# EAGLE design LurkerNanov20 (EAGLE 6.6.0)
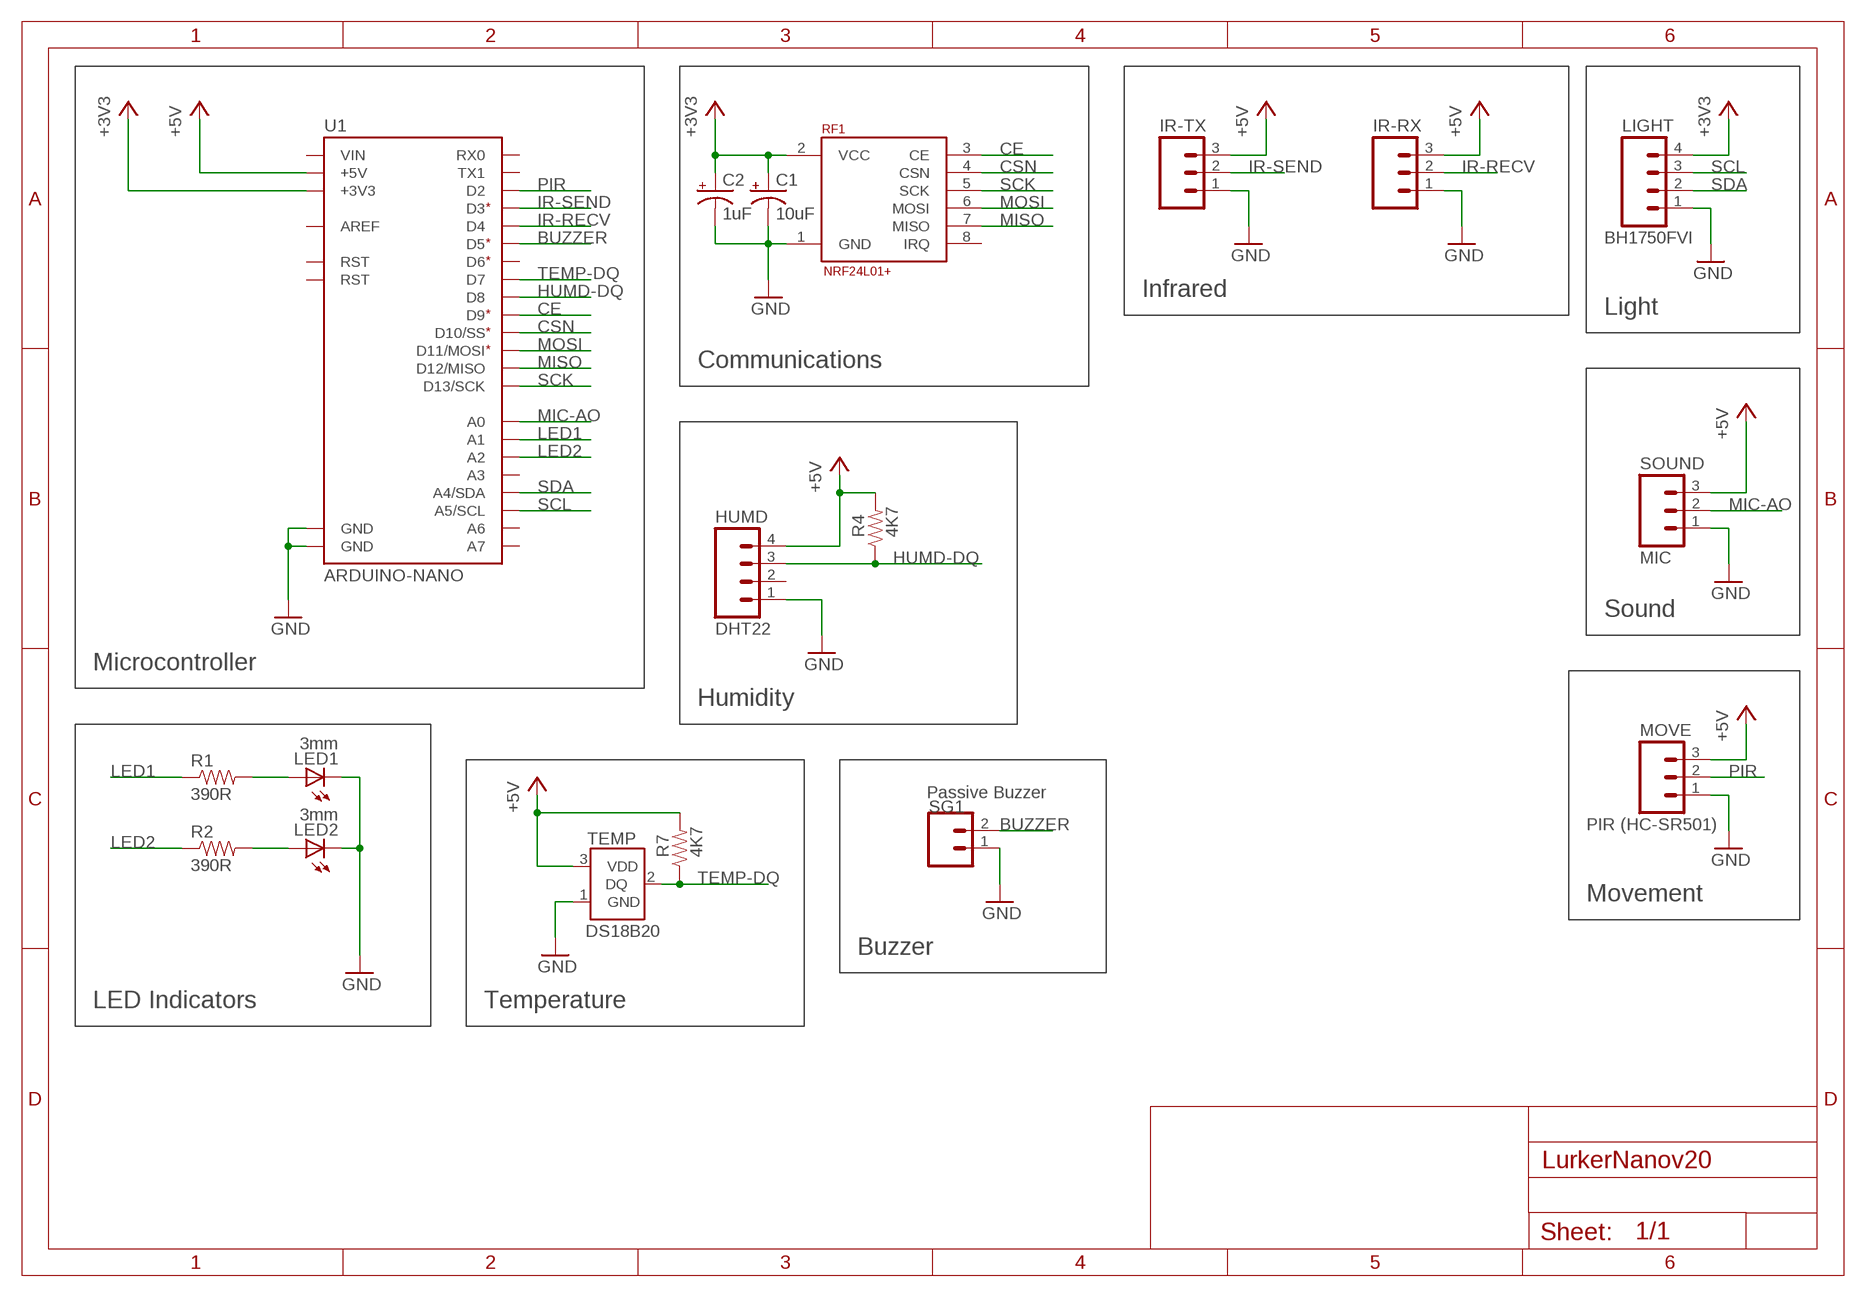
[diagram p0: schematic, sheet 1, part 1 of 2]
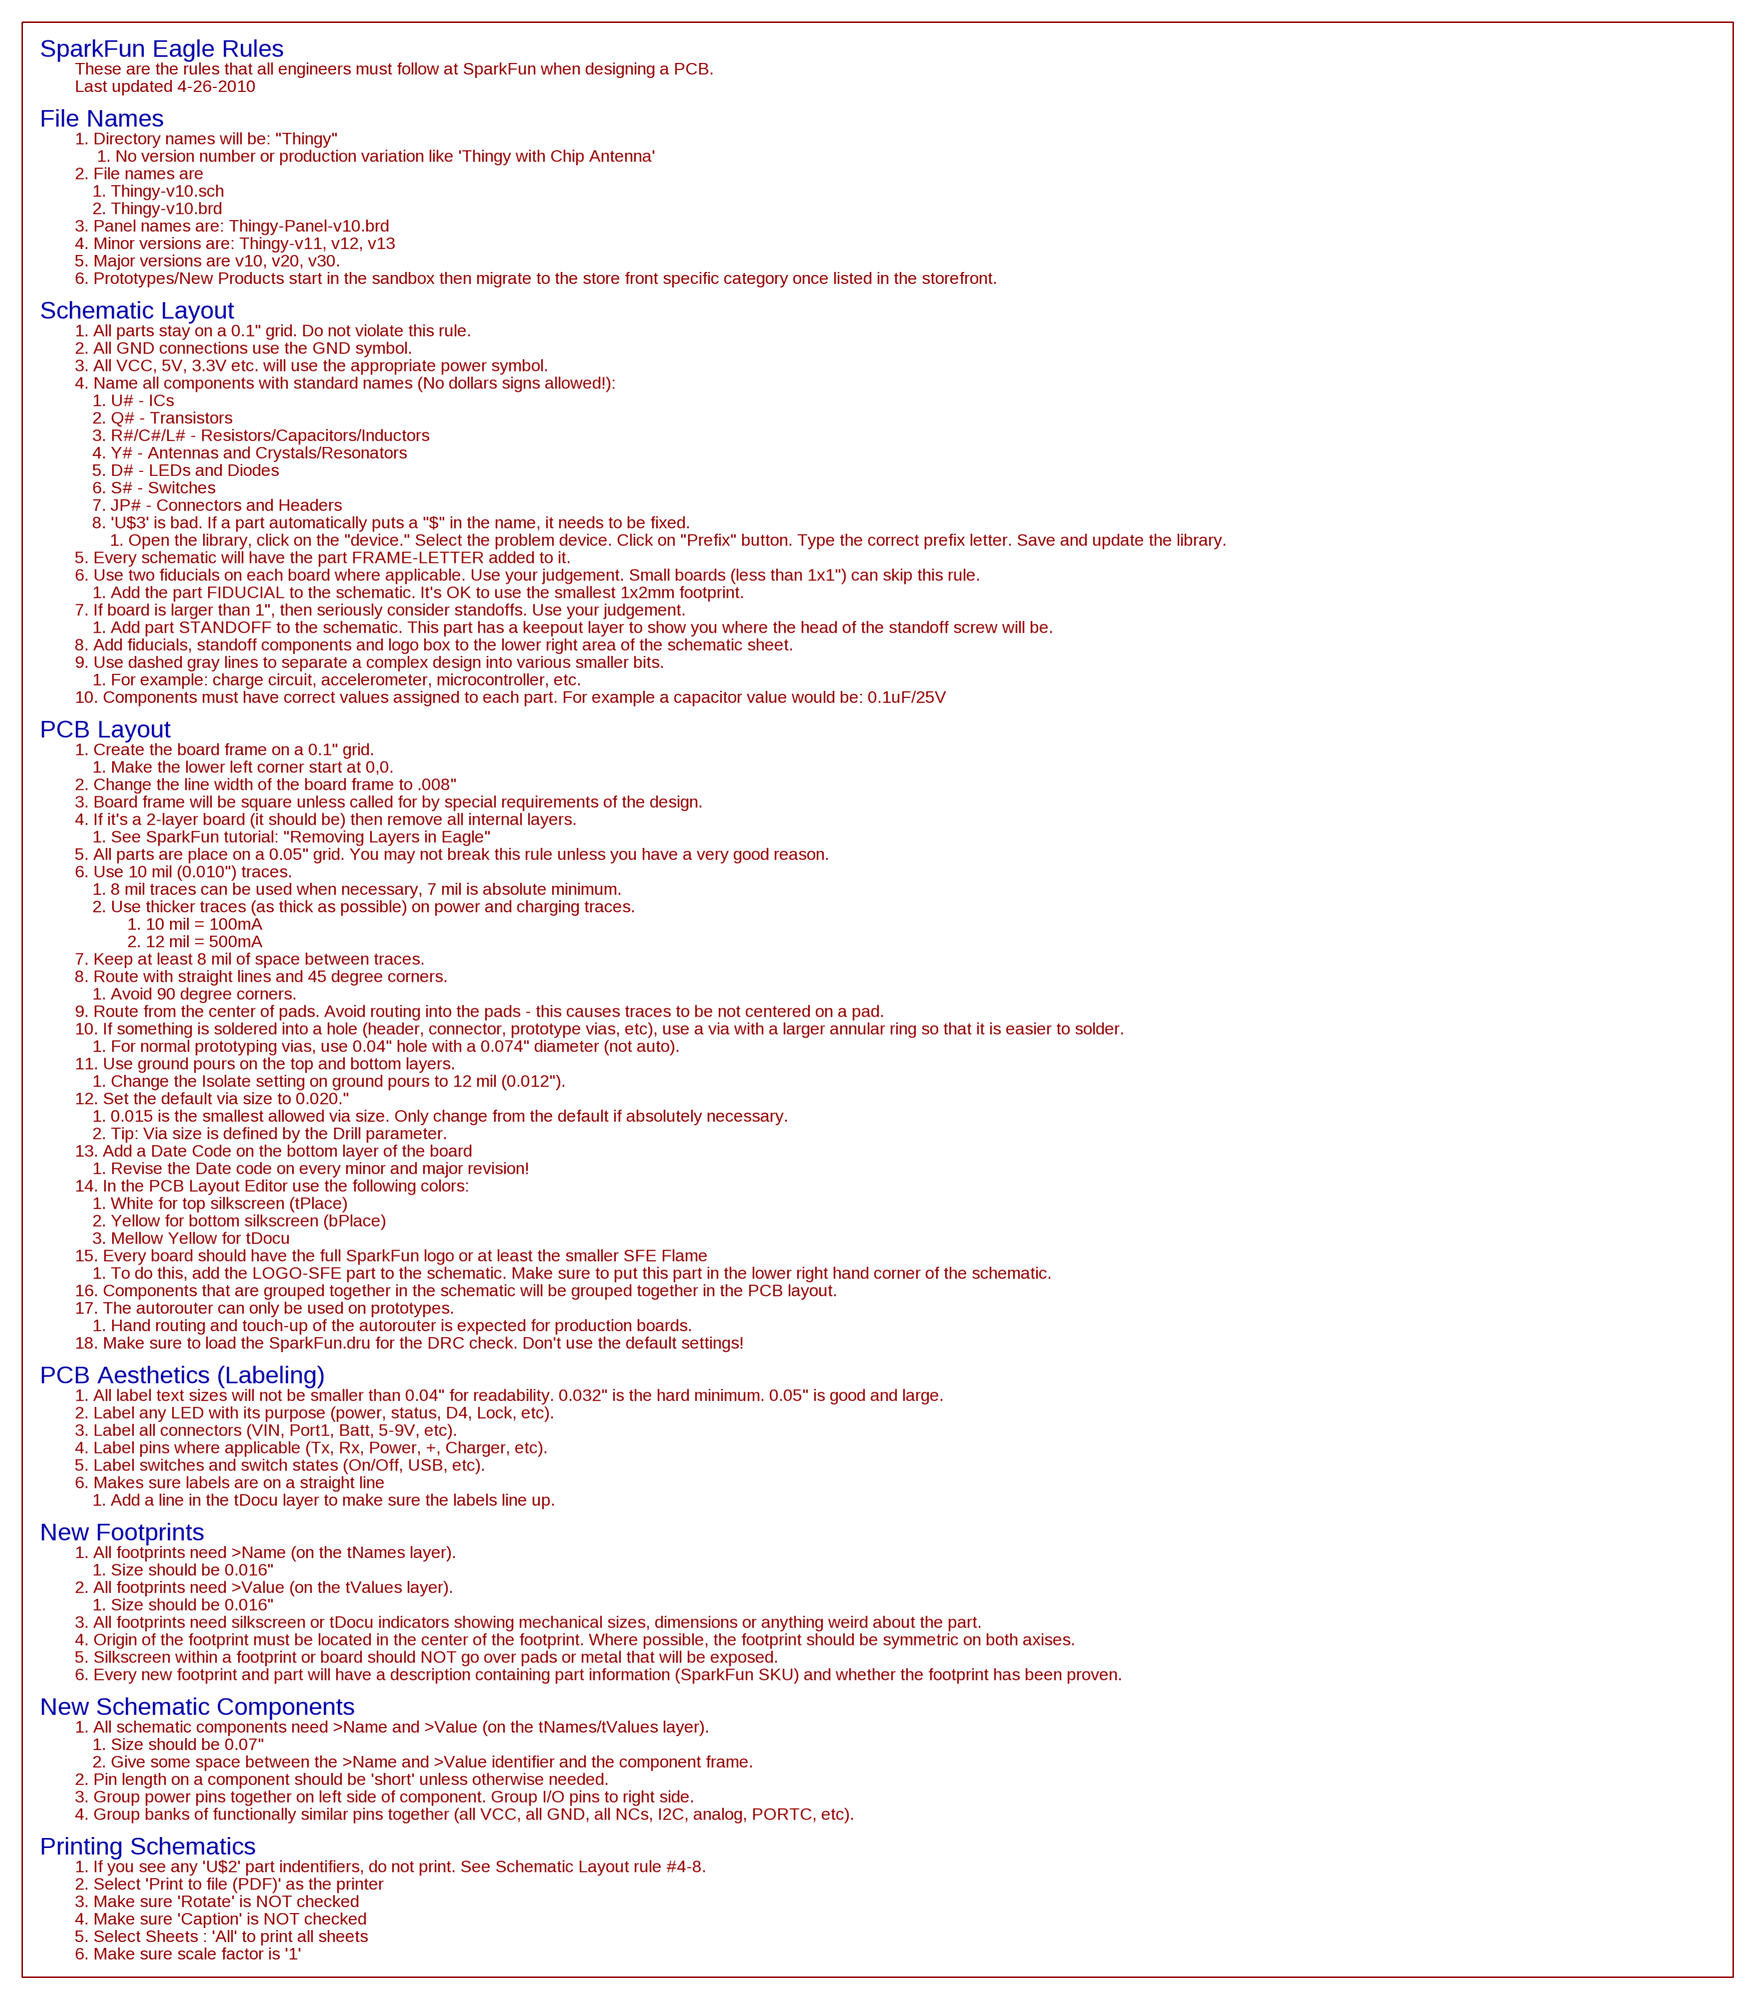
[diagram p1: schematic, sheet 1, part 2 of 2]

## Parts
C1  10uF  CAP_POL1206  [EIA3216]
C2  1uF  CAP_POL1206  [EIA3216]
HUMD  DHT22  M04PTH  [1X04]
IR-RX  M03PTH  [1X03]
IR-TX  M03PTH  [1X03]
LED1  3mm  LED3MM  [LED3MM]
LED2  3mm  LED3MM  [LED3MM]
LIGHT  BH1750FVI  M04PTH  [1X04]
MOVE  PIR (HC-SR501)  M03PTH  [1X03]
R1  390R  RESISTOR1206  [1206]
R2  390R  RESISTOR1206  [1206]
R4  4K7  RESISTOR1206  [1206]
R7  4K7  RESISTOR1206  [1206]
RF1  NRF24L01+  [NRF24L01+-HEADER]
SG1  Passive Buzzer  M02PTH  [1X02]
SOUND  MIC  M03PTH  [1X03]
TEMP  DS18B20  [TO-92-AMMO]
U1  ARDUINO-NANO  [NANO-SHIELD]

## Nets
+3V3: C1.A(+) C2.A(+) LIGHT.4 RF1.2(VCC) U1.3V3(+3V3)
+5V: HUMD.4 IR-RX.3 IR-TX.3 MOVE.3 R4.2 R7.2 SOUND.3 TEMP.3(VDD) U1.5V(+5V)
BUZZER: SG1.2 U1.D5
CE: RF1.3(CE) U1.D9
CSN: RF1.4(CSN) U1.D10(D10/SS)
GND: C1.C(-) C2.C(-) HUMD.1 IR-RX.1 IR-TX.1 LED1.K(C) LED2.K(C) LIGHT.1 MOVE.1 RF1.1(GND) SG1.1 SOUND.1 TEMP.1(GND) U1.GND@0(GND) U1.GND@1(GND)
HUMD-DQ: HUMD.3 R4.1 U1.D8
IR-RECV: IR-RX.2 U1.D4
IR-SEND: IR-TX.2 U1.D3
LED1: R1.1 U1.A1
LED2: R2.1 U1.A2
MIC-AO: SOUND.2 U1.A0
MISO: RF1.7(MISO) U1.D12(D12/MISO)
MOSI: RF1.6(MOSI) U1.D11(D11/MOSI)
N$1: LED1.A R1.2
N$2: LED2.A R2.2
PIR: MOVE.2 U1.D2
SCK: RF1.5(SCK) U1.D13(D13/SCK)
SCL: LIGHT.3 U1.A5(A5/SCL)
SDA: LIGHT.2 U1.A4(A4/SDA)
TEMP-DQ: R7.1 TEMP.2(DQ) U1.D7
Unconnected: HUMD.2 RF1.8(IRQ) U1.A3 U1.A6 U1.A7 U1.D6 U1.REF(AREF) U1.RST U1.RST@0(RST) U1.RX(RX0) U1.TX(TX1)

## Notes on the sheet
- Infrared
- Light
- Communications
- Sound
- Microcontroller
- Humidity
- Movement
- Buzzer
- LED Indicators | Temperature

## Power pins joined to a net without a drawn wire
VIN: U1.VIN

## Library data of the parts
C1 C2 = SparkFun-Capacitors:CAP_POL: Capacitor Polarized These are standard SMD and PTH capacitors. Normally 10uF, 47uF, and 100uF in electrolytic and tantalum varieties. Always verify the external diameter of the through hole cap, it varies with capacity, voltage, and manufacturer. The EIA devices should be standard.
HUMD LIGHT = SparkFun-Connectors:M04: Header 4 Standard 4-pin 0.1" header. Use with straight break away headers (SKU : PRT-00116), right angle break away headers (PRT-00553), swiss pins (PRT-00743), machine pins (PRT-00117), and female headers (PRT-00115). Molex polarized connector foot print use with SKU : PRT-08231 with associated crimp pins and housings. 1MM SMD Version SKU: PRT-10208
IR-RX IR-TX MOVE SOUND = SparkFun-Connectors:M03: Header 3 Standard 3-pin 0.1" header. Use with straight break away headers (SKU : PRT-00116), right angle break away headers (PRT-00553), swiss pins (PRT-00743), machine pins (PRT-00117), and female headers (PRT-00115). Molex polarized connector foot print use with SKU : PRT-08232 with associated crimp pins and housings.
LED1 LED2 = SparkFun-LED:LED: LEDs Standard schematic elements and footprints for 5mm, 3mm, 1206, and 0603 sized LEDs. 5mm - Spark Fun Electronics SKU : COM-00529 (and others)
R1 R2 R4 R7 = SparkFun-Resistors:RESISTOR: Resistor Basic schematic elements and footprints for 0603, 1206, and PTH resistors.
RF1 = Leenix:NRF24L01+
SG1 = SparkFun-Connectors:M02: Header 2 Standard 2-pin 0.1" header. Use with straight break away headers (SKU : PRT-00116), right angle break away headers (PRT-00553), swiss pins (PRT-00743), machine pins (PRT-00117), and female headers (PRT-00115). Molex polarized connector foot print use with SKU : PRT-08233 with associated crimp pins and housings.
TEMP = Leenix:DS18B20
U1 = Leenix:ARDUINO-NANO

## Board
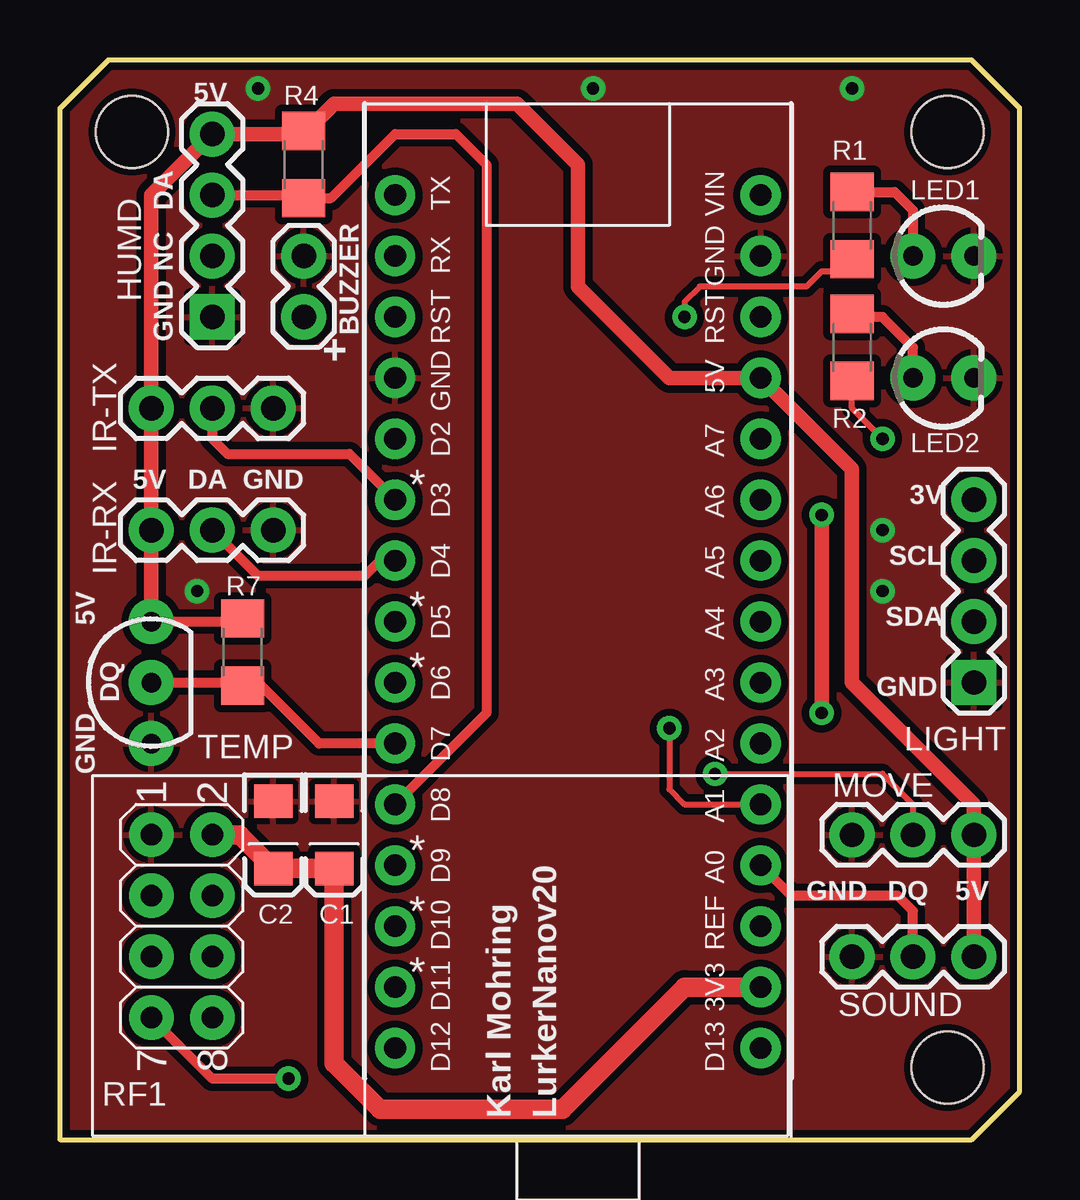
[diagram p2: board, top side]
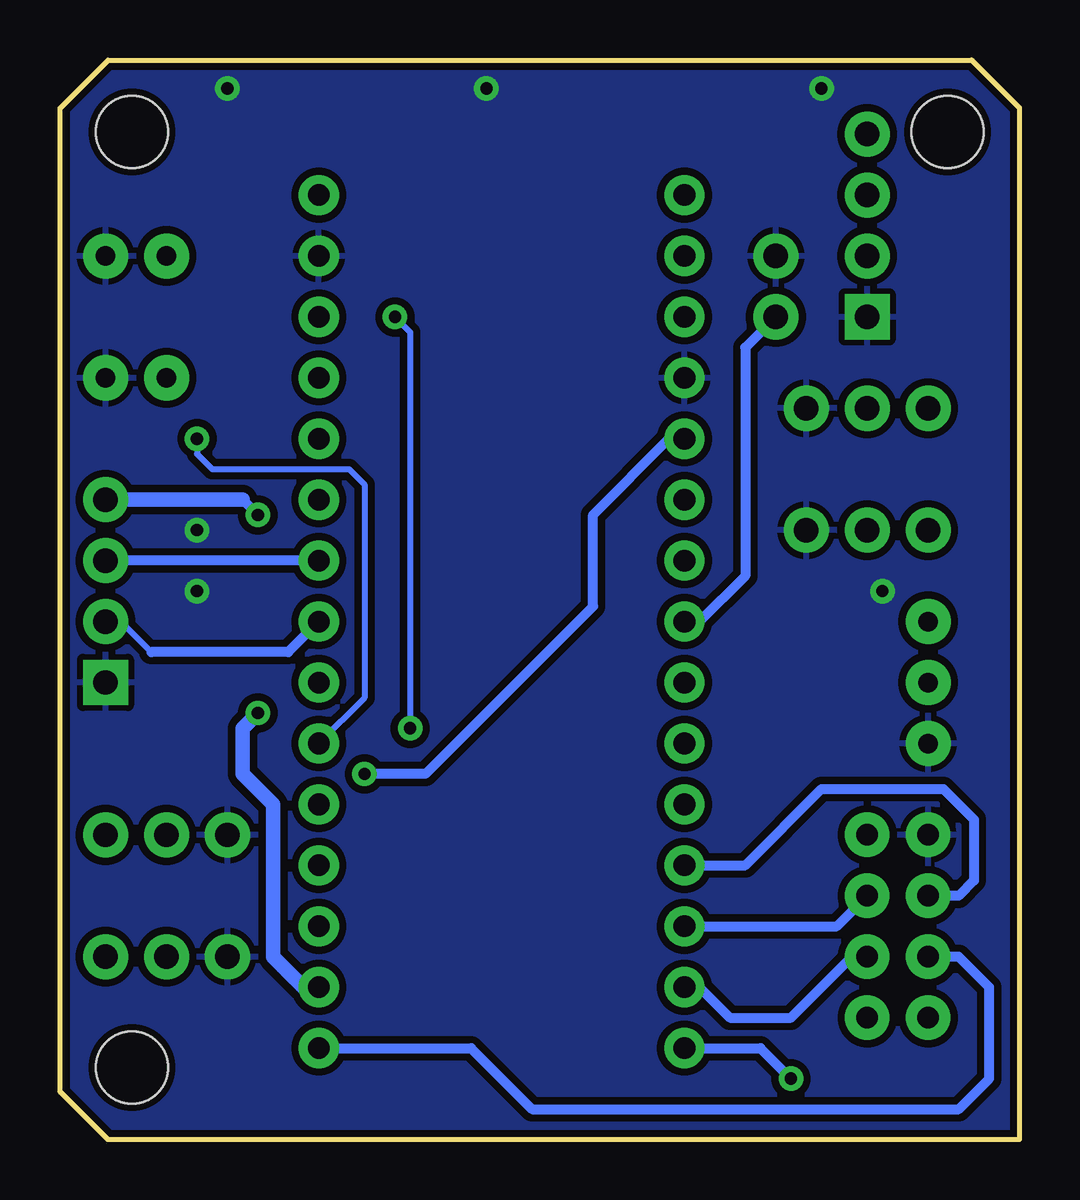
[diagram p3: board, bottom side, seen from below]

Size 40 x 45 mm. Coordinates in mm from the lower left corner, seen from the top.
Outline: 0,0 38,0 40,2 40,43 38,45 2,45 0,43 0,0
Copper layers (1*16): Top 0.035mm / dielectric 1.5mm / Bottom 0.035mm
Design rules "SparkFun": minimum track width 8mil, minimum drill 20mil, track to track 8mil, track to pad 8mil, pad to pad 8mil, via to via 8mil, smd to smd 8mil, copper to edge 10mil, drill to drill 8mil, minimum pad ring 12mil, minimum via ring 10mil, stop-mask expansion 4mil, vias tented up to drill 25mil, thermal gap 10mil
Holes 3 mm at 37,42 37,3 3,42

### Footprints (pad centres in the part's own frame; a part is rotated, then mirrored left to right if it is on the bottom)
EIA3216 = smd 1.4 x 1.6: A 1.4,0; C -1.4,0
1X04 = drill 1.016 pad 1.88 square: 1 0,0 | drill 1.016 pad 1.88: 2 2.54,0; 3 5.08,0; 4 7.62,0
1X03 = drill 1.016 pad 1.88: 1 0,0; 2 2.54,0; 3 5.08,0
LED3MM = drill 0.813 pad 1.88: A -1.27,0; K 1.27,0
1206 = smd 1.6 x 1.8: 1 -1.4,0; 2 1.4,0
NRF24L01+-HEADER = drill 0.9 pad 1.85: 1 -2.54,-2.54; 2 -2.54,0; 3 0,-2.54; 4 0,0; 5 2.54,-2.54; 6 2.54,0; 7 5.08,-2.54; 8 5.08,0
1X02 = drill 1.016 pad 1.88: 1 0,0; 2 2.54,0
TO-92-AMMO = drill 0.813 pad 1.88: 1 -2.54,0; 2 0,0; 3 2.54,0
NANO-SHIELD = drill 0.9 pad 1.676: 3V3 15.24,2.54; 5V 15.24,27.94; A0 15.24,7.62; A1 15.24,10.16; A2 15.24,12.7; A3 15.24,15.24; A4 15.24,17.78; A5 15.24,20.32; A6 15.24,22.86; A7 15.24,25.4; D2 0,25.4; D3 0,22.86; D4 0,20.32; D5 0,17.78; D6 0,15.24; D7 0,12.7; D8 0,10.16; D9 0,7.62; D10 0,5.08; D11 0,2.54; D12 0,0; D13 15.24,0; GND@0 0,27.94; GND@1 15.24,33.02; REF 15.24,5.08; RST 15.24,30.48; RST@0 0,30.48; RX 0,33.02; TX 0,35.56; VIN 15.24,35.56

### Placement (x,y rotation side)
C1  11.43,12.7 270 top
C2  8.89,12.7 270 top
HUMD  6.35,34.29 90 top
IR-RX  8.89,25.4 180 top
IR-TX  8.89,30.48 180 top
LED1  36.83,36.83 0 top
LED2  36.83,31.75 0 top
LIGHT  38.1,19.05 90 top
MOVE  33.02,12.7 0 top
R1  33.02,38.1 90 top
R2  33.02,33.02 90 top
R4  10.16,40.64 90 top
R7  7.62,20.32 90 top
RF1  6.35,10.16 270 top
SG1  10.16,36.83 270 top
SOUND  33.02,7.62 0 top
TEMP  3.81,19.05 90 top
U1  13.97,3.81 0 top

### Tracks (layer width: path | path; a pad name or v marks a point on that pad's centre or on a via)
+3V3  (via drill 0.51)
  Top 0.61: v31.75,17.78 v31.75,26.04
  Top 0.813: RF1.2 7.49,12.7 C2.A C1.A 11.43,3.17 13.34,1.27 20.95,1.27 26.04,6.35 U1.3V3
  Bottom 0.406: 32.38,26.67 v31.75,26.04
  Bottom 0.61: LIGHT.4 32.38,26.67 | U1.3V3 29.84,6.35 31.11,7.62 31.11,13.97 32.38,15.24 32.38,17.14 v31.75,17.78
+5V
  Top 0.254: 10.03,41.91 R4.2 10.16,41.91
  Top 0.406: TEMP.3 7.49,21.59 R7.2
  Top 0.61: 10.16,41.91 11.43,43.18 19.05,43.18 21.59,40.64 21.59,35.56 25.4,31.75 U1.5V 33.02,27.94 33.02,19.68 33.02,19.05 38.1,13.97 MOVE.3 SOUND.3 | TEMP.3 IR-RX.3 IR-TX.3 3.81,39.37 HUMD.4 10.03,41.91
BUZZER
  Bottom 0.406: U1.D5 13.34,21.59 11.43,23.5 11.43,33.02 SG1.2
CE
  Bottom 0.406: U1.D9 11.43,11.43 8.26,14.61 3.17,14.61 1.91,13.34 1.91,10.79 2.54,10.16 RF1.3
CSN
  Bottom 0.406: U1.D10 7.62,8.89 RF1.4
GND  (via drill 0.51)
  other vias: 33.02,43.81 8.26,43.81 22.23,43.81 5.71,22.86 34.29,25.4 34.29,22.86
  pour Top (isolate 0.305): 0,0 0,43.18 1.91,45.09 40.64,45.09 40.64,2.54 38.1,0
  pour Bottom (isolate 0.305): 40.64,0 40.64,42.55 38.1,45.09 -0.64,45.09 -0.64,1.27 1.91,-1.27
HUMD-DQ
  Top 0.254: R4.1 10.16,39.37
  Top 0.406: HUMD.3 7.49,39.37 10.16,39.37 | R4.1 11.3,39.24 13.97,41.91 16.51,41.91 17.78,40.64 17.78,17.78 U1.D8
IR-RECV
  Top 0.406: IR-RX.2 8.26,23.5 12.7,23.5 13.34,24.13 U1.D4
IR-SEND
  Top 0.406: IR-TX.2 6.35,29.21 6.99,28.57 12.06,28.57 U1.D3
LED1  (via drill 0.51)
  Top 0.254: v26.04,34.29 26.04,34.92 26.67,35.56 31.11,35.56 31.75,36.2 33.02,36.2 R1.1 | v25.4,17.14 25.4,14.61 26.04,13.97 U1.A1
  Bottom 0.254: v26.04,34.29 25.4,33.66 v25.4,17.14
LED2  (via drill 0.51)
  Top 0.254: v34.29,29.21 33.02,30.48 R2.1
  Bottom 0.254: U1.A2 27.3,18.41 27.3,27.3 27.94,27.94 33.66,27.94 34.29,28.57 v34.29,29.21
MIC-AO
  Top 0.406: U1.A0 30.48,10.16 34.92,10.16 35.56,9.53 SOUND.2
MISO  (via drill 0.51)
  Top 0.406: v9.53,2.54 6.35,2.54 RF1.7
  Bottom 0.406: U1.D12 10.79,3.81 v9.53,2.54
MOSI
  Bottom 0.406: U1.D11 13.34,6.35 12.06,5.08 9.53,5.08 6.99,7.62 RF1.6
N$1
  Top 0.406: R1.2 34.8,39.5 35.56,38.73 LED1.A
N$2
  Top 0.406: 32.52,34.92 R2.2 33.15,34.29 34.29,34.29 35.56,33.02 LED2.A
PIR  (via drill 0.51)
  Top 0.254: v27.3,15.24 34.29,15.24 35.56,13.97 MOVE.2
  Bottom 0.254: 14.61,29.21 U1.D2
  Bottom 0.406: 14.61,29.21 17.78,26.04 17.78,22.23 24.77,15.24 v27.3,15.24
SCK
  Bottom 0.406: U1.D13 22.86,3.81 20.32,1.27 2.54,1.27 1.27,2.54 1.27,6.35 2.54,7.62 RF1.5
SCL
  Bottom 0.406: U1.A5 LIGHT.3
SDA
  Bottom 0.254: 36.2,20.32 37.47,21.59 LIGHT.2
  Bottom 0.406: U1.A4 30.48,20.32 36.2,20.32
TEMP-DQ
  Top 0.406: TEMP.2 7.49,19.05 R7.1 8.38,18.92 10.79,16.51 U1.D7

### Text on the board
tPlace: 5V | DA | NC | BUZZER | GND | + | 5V | DA | GND | 3V | SCL | 5V | SDA | DQ | GND | GND | GND | DQ | 5V | Karl Mohring